# Altium schematic sheet [10] - FTDI.SchDoc: FTDI
size A3; Organization: Bjørn T. Brodtkorb; Address1: Frode Rinnans veg 161; Address2: 7050 Trondheim; DocumentNumber: 6598; Revision: 1.0; SheetNumber: 1; SheetTotal: 1
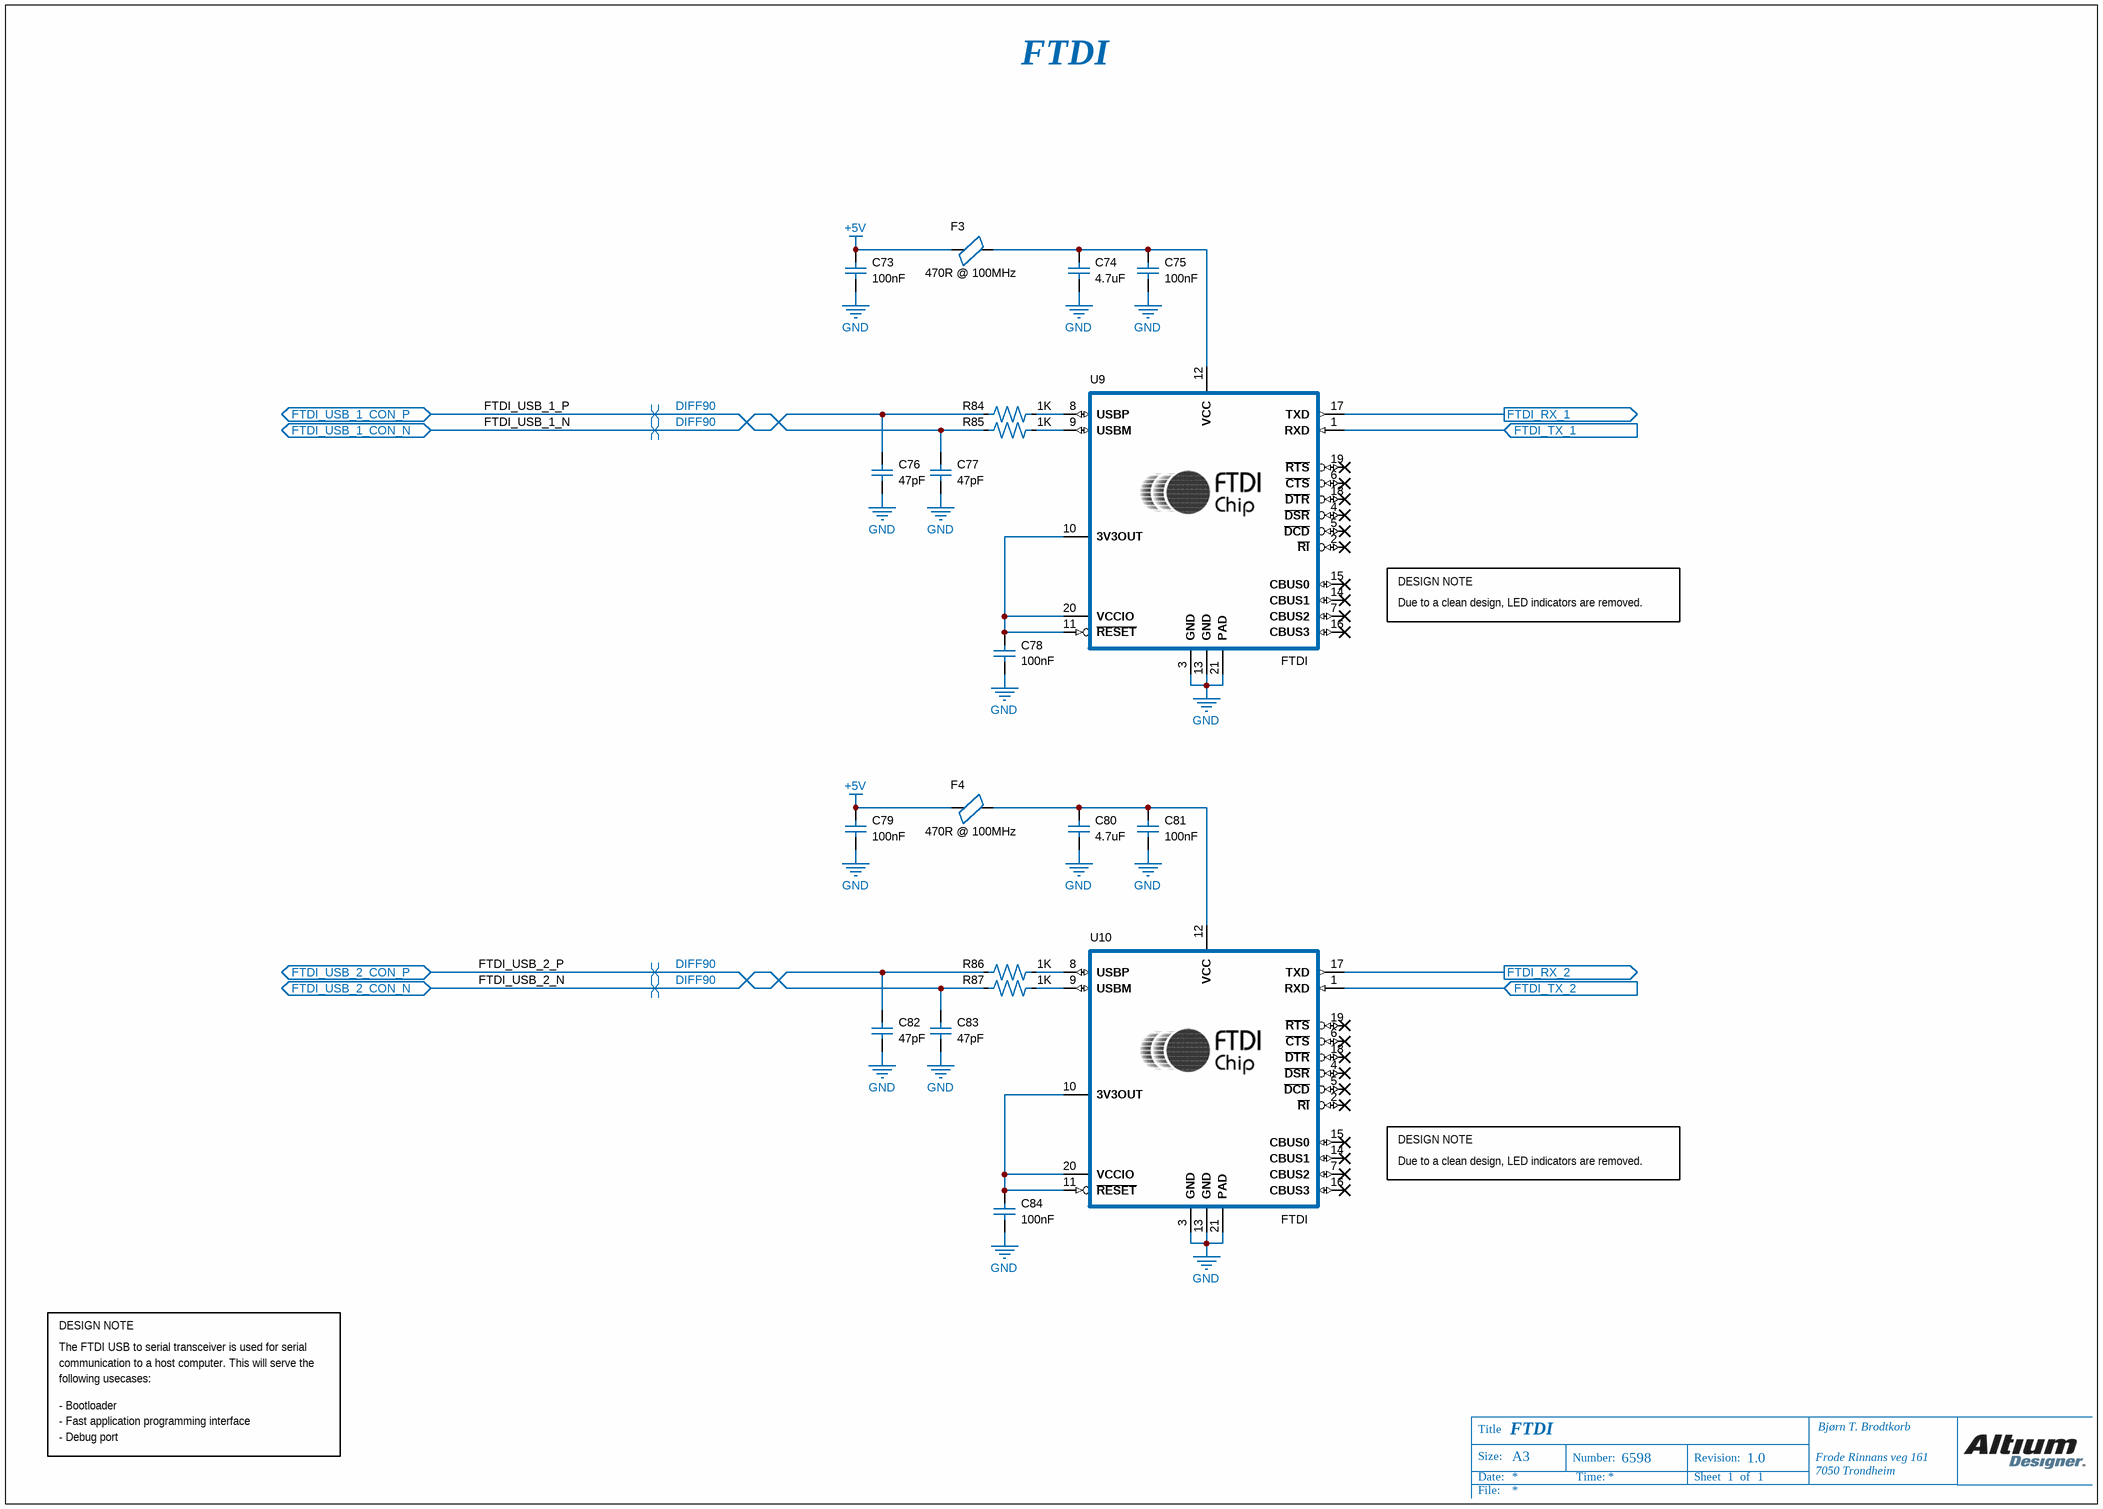
[diagram p0: [10] - FTDI.SchDoc]

## Parts
C73  value 100nF  [C0402]  (hidden comment: 04023C103KAT2A)
C74  value 4.7uF  [C0603]  (hidden comment: 02016D104KAT2A)
C75  value 100nF  [C0402]  (hidden comment: 04023C103KAT2A)
C76  value 47pF  [C0402]  (hidden comment: 04023C103KAT2A)
C77  value 47pF  [C0402]  (hidden comment: 04023C103KAT2A)
C78  value 100nF  [C0402]  (hidden comment: 04023C103KAT2A)
C79  value 100nF  [C0402]  (hidden comment: 04023C103KAT2A)
C80  value 4.7uF  [C0603]  (hidden comment: 02016D104KAT2A)
C81  value 100nF  [C0402]  (hidden comment: 04023C103KAT2A)
C82  value 47pF  [C0402]  (hidden comment: 04023C103KAT2A)
C83  value 47pF  [C0402]  (hidden comment: 04023C103KAT2A)
C84  value 100nF  [C0402]  (hidden comment: 04023C103KAT2A)
F3  value 470R @ 100MHz  [Ferrite bead 0402]  (hidden comment: BLM15AG102SN1D)
F4  value 470R @ 100MHz  [Ferrite bead 0402]  (hidden comment: BLM15AG102SN1D)
R84  value 1K  [R0402]  (hidden comment: CRCW04020000Z0ED)
R85  value 1K  [R0402]  (hidden comment: CRCW04020000Z0ED)
R86  value 1K  [R0402]  (hidden comment: CRCW04020000Z0ED)
R87  value 1K  [R0402]  (hidden comment: CRCW04020000Z0ED)
U9  FTDI  [FT231XQ-R]
U10  FTDI  [FT231XQ-R]

## Ports
FTDI_RX_1 (out), FTDI_RX_2 (out), FTDI_TX_1 (in), FTDI_TX_2 (in), FTDI_USB_1_CON_N (bidir), FTDI_USB_1_CON_P (bidir), FTDI_USB_2_CON_N (bidir), FTDI_USB_2_CON_P (bidir)

## Nets
+5V: C73.1 C79.1 F3.1 F4.1
GND: C73.2 C74.2 C75.2 C76.2 C77.2 C78.2 C79.2 C80.2 C81.2 C82.2 C83.2 C84.2 U9.3(GND) U9.13(GND) U9.21(PAD) U10.3(GND) U10.13(GND) U10.21(PAD)
FTDI_RX_1: U9.17(TXD) ; port FTDI_RX_1
FTDI_RX_2: U10.17(TXD) ; port FTDI_RX_2
FTDI_TX_1: U9.1(RXD) ; port FTDI_TX_1
FTDI_TX_2: U10.1(RXD) ; port FTDI_TX_2
FTDI_USB_1_N: C77.1 R85.1 ; port FTDI_USB_1_CON_N
FTDI_USB_1_P: C76.1 R84.1 ; port FTDI_USB_1_CON_P
FTDI_USB_2_N: C83.1 R87.1 ; port FTDI_USB_2_CON_N
FTDI_USB_2_P: C82.1 R86.1 ; port FTDI_USB_2_CON_P
NetC74_1: C74.1 C75.1 F3.2 U9.12(VCC)
NetC78_1: C78.1 U9.10(3V3OUT) U9.11(~{RESET}) U9.20(VCCIO)
NetC80_1: C80.1 C81.1 F4.2 U10.12(VCC)
NetC84_1: C84.1 U10.10(3V3OUT) U10.11(~{RESET}) U10.20(VCCIO)
NetR84_2: R84.2 U9.8(USBP)
NetR85_2: R85.2 U9.9(USBM)
NetR86_2: R86.2 U10.8(USBP)
NetR87_2: R87.2 U10.9(USBM)

Not connected (* = marked no-connect by the designer): U9 2(~{RI})* 4(~{DSR})* 5(~{DCD})* 6(~{CTS})* 7(CBUS2)* 14(CBUS1)* 15(CBUS0)* 16(CBUS3)* 18(~{DTR})* 19(~{RTS})*; U10 2(~{RI})* 4(~{DSR})* 5(~{DCD})* 6(~{CTS})* 7(CBUS2)* 14(CBUS1)* 15(CBUS0)* 16(CBUS3)* 18(~{DTR})* 19(~{RTS})*

## Layout directives
differential pair; differential pair class DIFF90: FTDI_USB_1_N, FTDI_USB_1_P, FTDI_USB_2_N, FTDI_USB_2_P

## Notes on the sheet
- FTDI
- DESIGN NOTE
- Due to a clean design, LED indicators are removed.
- The FTDI USB to serial transceiver is used for serial
- communication to a host computer. This will serve the
- following usecases:
- - Bootloader
- - Fast application programming interface
- - Debug port
- Title
- Size:
- A3
- Number:
- Revision:
- Date:
- File:
- Time:
- Sheet
- of

## Library data of the parts
C73 C75-C79 C81-C84 = 04023C103KAT2A: C0402
C74 C80 = 02016D104KAT2A: C0603
F3 F4 = BLM15AG102SN1D: Ferrite bead 0402
R84-R87 = CRCW04020000Z0ED: R0402
U9 U10 = FT231XQ-R: USB to RS-232 converter; Supplier Part Number 1: 2081330; Supplier 1: Farnell